# Altium schematic sheet Transmitter.SchDoc
size A4; SheetNumber: 2; SheetTotal: 2; SPICEModelCacheDROQVVJG: <root> / <DocumentId>DROQVVJG</DocumentId> / <CacheFrame Number="0"> / <Model Name="led0" Kind="MDL"> / <Text>*Typ INFRARED GaAs LED: Vf=1.2V Vr=5V If=40mA trr=3uS / *LED Pinout: 1=A, 2=K / .MODEL LED0 D (IS=93.5P RS=84M N=2.63 BV=5 IBV=10U / + CJO=2.97P VJ=.75 M=.333 TT=4.32U)</Text> / </Model> / </CacheFrame> / </root>
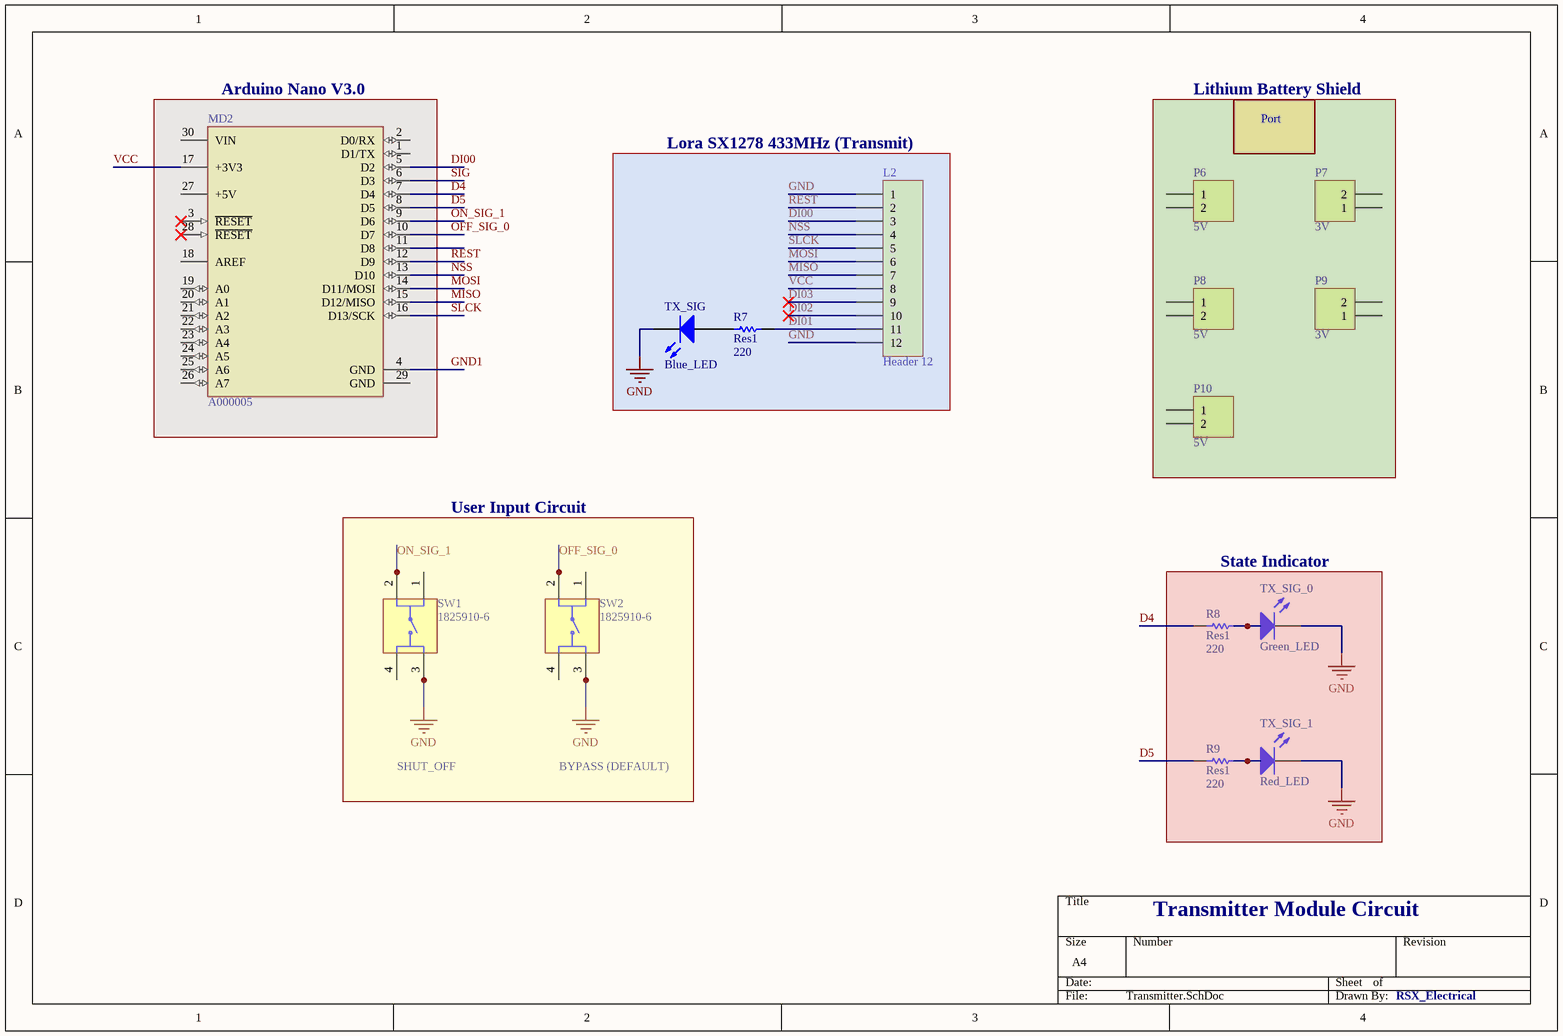
[diagram p0: Transmitter.SchDoc]

## Parts
L2  Header 12  [HDR1X12]
MD2  A000005  [FP-A000005-MFG]
P6  5V  [HDR1X2]
P7  3V  [HDR1X2]
P8  5V  [HDR1X2]
P9  3V  [HDR1X2]
P10  5V  [HDR1X2]
R7  Res1  value 220  [AXIAL-0.3]
R8  Res1  value 220  [AXIAL-0.3]
R9  Res1  value 220  [AXIAL-0.3]
SW1  1825910-6  [SW_1825910-6-4]
SW2  1825910-6  [SW_1825910-6-4]
TX_SIG  Blue_LED  [LED-0]
TX_SIG_0  Green_LED  [LED-0]
TX_SIG_1  Red_LED  [LED-0]

## Blocks framed on the sheet
Arduino Nano V3.0: MD2
Lithium Battery Shield: P6-P10
Lora SX1278 433MHz (Transmit): L2 R7 TX_SIG
User Input Circuit: SW1 SW2
State Indicator: R8 R9 TX_SIG_0 TX_SIG_1

## Nets
GND: L2.1 L2.12 SW1.3 SW2.3 TX_SIG.2(K) TX_SIG_0.2(K) TX_SIG_1.2(K)
D4: MD2.7(D4) R8.2
D5: MD2.8(D5) R9.2
DI00: L2.3 MD2.5(D2)
DI01: L2.11 R7.1
DI02: L2.10
DI03: L2.9
GND1: MD2.4(GND)
MISO: L2.7 MD2.15(D12/MISO)
MOSI: L2.6 MD2.14(D11/MOSI)
NSS: L2.4 MD2.13(D10)
OFF_SIG_0: MD2.10(D7) SW2.2
ON_SIG_1: MD2.9(D6) SW1.2
REST: L2.2 MD2.12(D9)
SIG: MD2.6(D3)
SLCK: L2.5 MD2.16(D13/SCK)
VCC: L2.8 MD2.17(+3V3)
NetR7_2: R7.2 TX_SIG.1(A)
NetR8_1: R8.1 TX_SIG_0.1(A)
NetR9_1: R9.1 TX_SIG_1.1(A)

Not connected (* = marked no-connect by the designer): MD2 1(D1/TX) 2(D0/RX) 3(~{RESET})* 11(D8) 18(AREF) 19(A0) 20(A1) 21(A2) 22(A3) 23(A4) 24(A5) 25(A6) 26(A7) 27(+5V) 28(~{RESET})* 29(GND) 30(VIN); P6 1 2; P7 1 2; P8 1 2; P9 1 2; P10 1 2; SW1 1 4; SW2 1 4

## Notes on the sheet
- Port
- SHUT_OFF
- BYPASS (DEFAULT)
- Transmitter Module Circuit
- RSX_Electrical

## Library data of the parts
L2 = Header 12: Header, 12-Pin; LatestRevisionDate: 17-Jul-2002; LatestRevisionNote: Re-released for DXP Platform.; Publisher: Altium Limited
MD2 = CMP-189986-000002-1: ARDUINO NANO ATMEGA328 EVAL BRD; Number of Bits: 8; Evaluation Kit: Yes; Operating Supply Voltage: 12V; Interface: I2C; Data Bus Width: 8b; Core Architecture: AVR; Packaging: Bulk; Length: 7inch; Package Quantity: 50; Width: 5inch; REACH SVHC: No SVHC; Weight: 0.358383oz; Series: AVR® ATmega; Height: 0.25inch
P6-P10 = Header 2: Header, 2-Pin; LatestRevisionDate: 17-Jul-2002; LatestRevisionNote: Re-released for DXP Platform.; Publisher: Altium Limited
R7-R9 = Res1: Resistor; Published: 8-Jun-2000; LatestRevisionDate: 17-Jul-2002; LatestRevisionNote: Re-released for DXP Platform.; PackageReference: AXIAL-0.3; Publisher: Altium Limited; PackageDescription: Axial Device, Thru-Hole; 2 Leads; 0.3 in Pin Spacing
SW1 SW2 = 1825910-6: Switch Tactile OFF (ON) SPST Round Button PC Pins 0.05A 24VDC 100000Cycles 1.57N Thru-Hole Loose; Package: None; MP: 1825910-6; Value: *; Price: None; Availability: Unavailable
TX_SIG TX_SIG_0 TX_SIG_1 = LED0: Typical INFRARED GaAs LED; Published: 8-Jun-2000; LatestRevisionDate: 08-Jul-2005; LatestRevisionNote: Mech Layer 1 removed.; PackageReference: LED-0; Publisher: Altium Limited; PackageDescription: LED; 2 Leads